# EAGLE design V4-MySensors-LoRa-V004 (EAGLE 9.3.0)
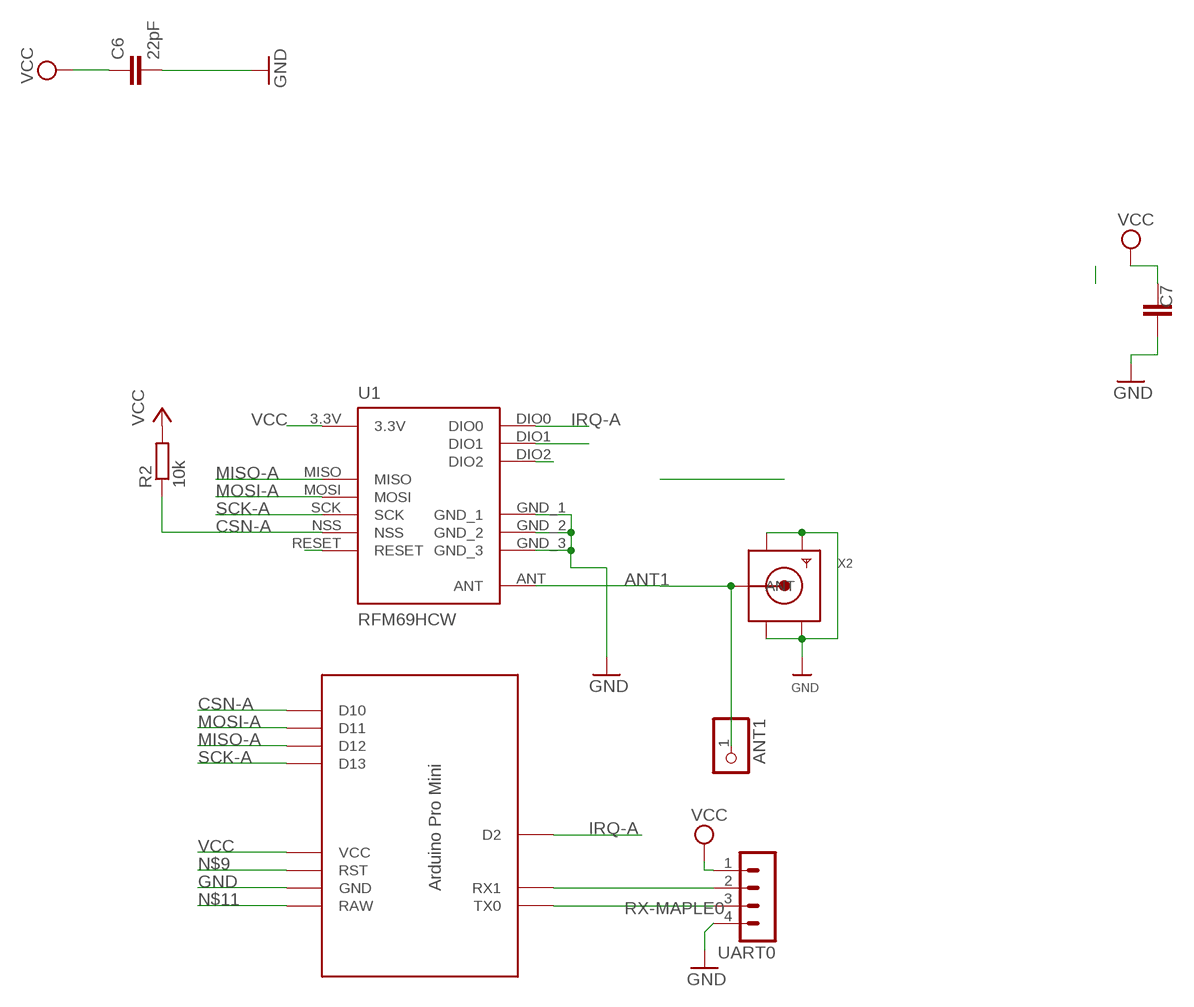
[diagram p0: schematic, sheet 1]

## Parts
ANT1  PINHD-1X1  [1X01]
C6  22pF  C-EUC0805  [C0805]
C7  C-EUC1812  [C1812]
R2  10k  R-EU_M0805  [M0805]
U1  RFM69HCW  [RFM69HCW-XXXS2]
U$1  MARTIN-PROMINI-SPI  [MARTIN-PRO-SPI]
UART0  MA04-1  [MA04-1]
X2  SMACONNECTOR_EDGE  [SMA_EDGELAUNCH]

## Nets
ANT1: ANT1.1 U1.ANT X2.P(ANT)
CSN-A: R2.1 U1.NSS U$1.D10
GND [PWR]: C6.2 C7.1 U1.GND_1 U1.GND_2 U1.GND_3 U$1.GND UART0.4 X2.GND@1(GND4) X2.GND@2(GND3) X2.GND@3(GND2) X2.GND@4(GND1)
IRQ-A: U1.DIO0 U$1.D2
MISO-A: U1.MISO U$1.D12
MOSI-A: U1.MOSI U$1.D11
N$2: U$1.RX1 UART0.2
N$3: U1.RESET
N$9: U$1.RST
N$11: U$1.RAW
N$14: U1.DIO2
N$15: U1.DIO1
RX-MAPLE0: U$1.TX0 UART0.3
SCK-A: U1.SCK U$1.D13
VCC [PWR]: C6.1 C7.2 R2.2 U1.3.3V U$1.VCC UART0.1

## Library data of the parts
ANT1 = pinhead:PINHD-1X1: PIN HEADER
C6 C7 = rcl:C-EU: CAPACITOR, European symbol; SPICEPREFIX: C
R2 = rcl:R-EU_: RESISTOR, European symbol
U1 = doug:RFM69H
U$1 = Arduino-clone:MARTIN-PROMINI-SPI
UART0 = con-lstb:MA04-1: PIN HEADER; OC_FARNELL: unknown; OC_NEWARK: unknown
X2 = adafruit:SMACONNECTOR: SMA Connector 90° DIP SMA Connector, 50 Ohm (4UConnector: 07259)

## Net classes
0 default: width 0.305 mm
1 PWR: width 0.457 mm

## Board
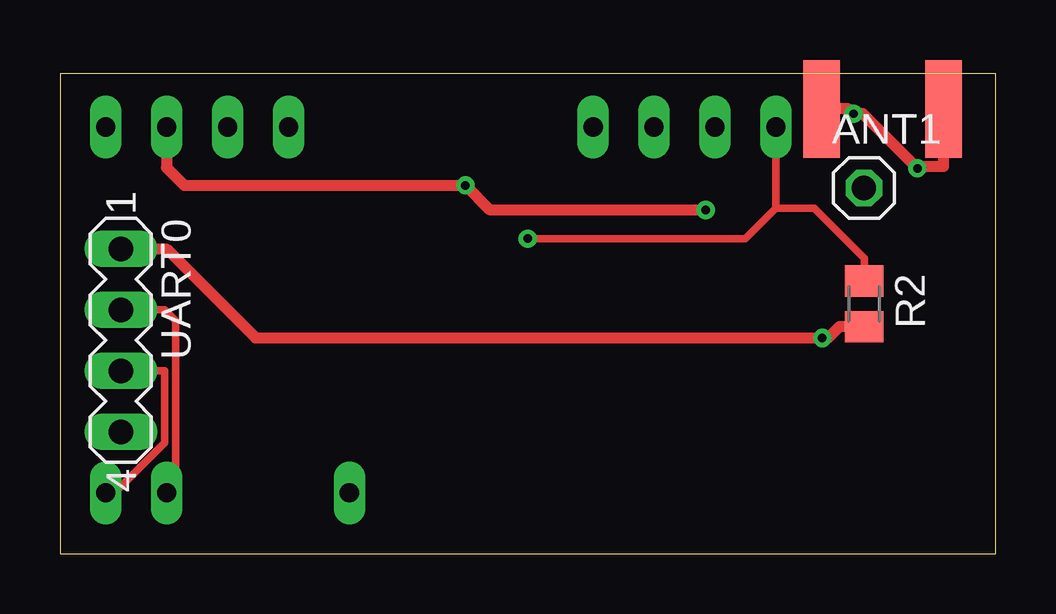
[diagram p1: board, top side]
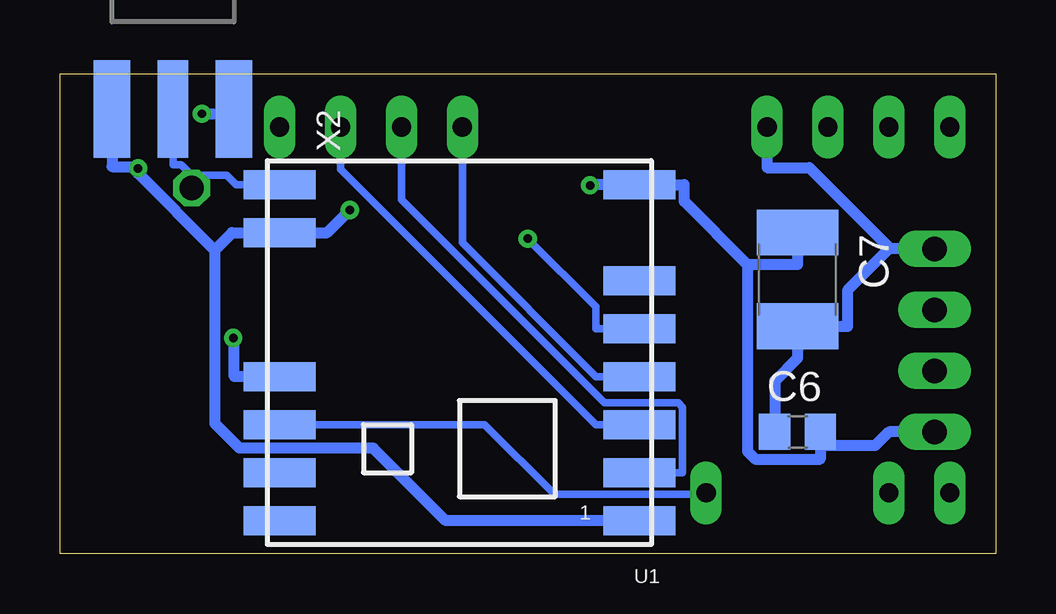
[diagram p2: board, bottom side, seen from below]

Size 39 x 20 mm. Coordinates in mm from the lower left corner, seen from the top.
Outline: 0,0 39,0 39,20 0,20 0,0
Copper layers (1*16): Top 0.035mm / dielectric 1.5mm / Bottom 0.035mm
Design rules "default": minimum track width 6mil, minimum drill 0.35mm, track to track 6mil, track to pad 6mil, pad to pad 6mil, via to via 6mil, smd to smd 6mil, copper to edge 40mil, drill to drill 6mil, minimum pad ring 10mil, minimum via ring 8mil, stop-mask expansion 4mil, vias tented up to drill 0mil, thermal gap 10mil

### Footprints (pad centres in the part's own frame; a part is rotated, then mirrored left to right if it is on the bottom)
1X01 = drill 1.016 octagon: 1 0,0
C0805 = smd 1.3 x 1.5: 1 -0.95,0; 2 0.95,0
C1812 = smd 1.9 x 3.4: 1 -1.95,0; 2 1.95,0
M0805 = smd 1.3 x 1.6: 1 -0.95,0; 2 0.95,0
RFM69HCW-XXXS2 = smd 3 x 1.2: 3.3V 7.5,1; ANT 7.5,-7; DIO0 7.5,3; DIO1 7.5,5; DIO2 7.5,7; GND_1 7.5,-5; GND_2 -7.5,-7; GND_3 -7.5,7; MISO -7.5,5; MOSI -7.5,3; NSS -7.5,-1; RESET -7.5,-3; SCK -7.5,1
MARTIN-PRO-SPI = drill 0.8 long: D2 -5.08,-3.81; D10 10.16,-21.59; D11 10.16,-19.05; D12 10.16,-16.51; D13 10.16,-13.97; GND 10.16,3.81; RAW 10.16,6.35; RST 10.16,1.27; RX1 -5.08,3.81; TX0 -5.08,6.35; VCC 10.16,-1.27
MA04-1 = drill 1.016 long: 1 -3.81,0; 2 -1.27,0; 3 1.27,0; 4 3.81,0
SMA_EDGELAUNCH = smd 4.064 x 1.524: GND@1 2.032,-2.54; GND@2 2.032,2.54 | smd 4.064 x 1.524 bottom: GND@3 2.032,2.54; GND@4 2.032,-2.54 | smd 4.064 x 1.27: P 2.032,0

### Placement (x,y rotation side)
ANT1  33.51,15.24 0 top
C6  8.26,5.08 0 bottom
C7  8.26,11.43 270 bottom
R2  33.53,10.41 270 top
U1  22.35,8.38 180 bottom
U$1  8.26,7.62 90 top
UART0  2.54,8.89 270 top
X2  34.29,20.57 270 bottom

### Tracks (layer width: path | path; a pad name or v marks a point on that pad's centre or on a via)
ANT1
  Bottom 0.305: X2.P 34.29,16.2 33.94,16.2 33.51,15.77 | U1.ANT 31.66,15.38 32.05,15.77 33.51,15.77 | ANT1.1 33.51,15.77
CSN-A  (via drill 0.35 pad 0.76)
  Top 0.305: R2.1 33.53,12.32 31.44,14.4 29.84,14.4 | v19.5,13.13 28.57,13.13 29.84,14.4 | 29.84,14.4 U$1.D10
  Bottom 0.305: U1.NSS 16.66,9.38 16.66,10.29 v19.5,13.13
GND  (via drill 0.35 pad 0.76)
  Top 0.457: X2.GND@2 32.88,18.54 v33.08,18.34 33.47,18.34 v35.75,16.06 35.82,16.13 36.83,16.13 X2.GND@1 | v26.92,14.32 17.93,14.32 v16.9,15.35 5.18,15.35 4.45,16.09 U$1.GND
  Bottom 0.457: v33.08,18.34 31.96,18.34 X2.GND@2 | 10.34,12.05 12.97,14.68 12.97,15.38 U1.GND_2 16.73,15.38 16.76,15.35 v16.9,15.35 | 10.34,12.05 10.34,4.27 10.02,3.95 7.3,3.95 7.3,4.51 | 10.34,12.05 8.26,12.05 C7.1 | 32.54,12.68 32.57,12.68 35.75,15.86 v35.75,16.06 35.82,16.13 36.83,16.13 X2.GND@1 | 32.54,12.68 31.83,13.38 U1.GND_1 27.86,13.38 v26.92,14.32 | U1.GND_3 22.93,1.38 25.94,4.4 31.51,4.4 32.54,5.42 32.54,12.68 | UART0.4 4.45,5.08 5.01,4.51 7.3,4.51 | C6.2 7.3,4.51
IRQ-A
  Bottom 0.305: U1.DIO0 21.3,5.38 18.39,2.48 12.13,2.48 U$1.D2
MISO-A
  Bottom 0.305: U1.MISO 13.05,3.38 13.05,6.11 13.23,6.29 16.3,6.29 24.77,14.76 U$1.D12
MOSI-A
  Bottom 0.305: U1.MOSI 16.66,5.38 27.3,16.03 U$1.D11
N$2
  Top 0.305: UART0.2 4.37,10.16 4.83,9.7 4.83,2.92 U$1.RX1
RX-MAPLE0
  Top 0.305: UART0.3 4.37,7.62 4.37,4.63 2.28,2.54 U$1.TX0
SCK-A
  Bottom 0.305: U1.SCK 16.66,7.38 22.23,12.95 U$1.D13
VCC  (via drill 0.35 pad 0.76)
  Top 0.457: UART0.1 4.45,12.7 8.15,8.99 v31.77,8.99 32.03,8.99 32.5,9.46 R2.2
  Bottom 0.457: U1.3.3V 31.73,7.38 31.73,8.95 v31.77,8.99 | U$1.VCC 9.53,16.09 7.77,16.09 4.45,12.77 4.45,12.7 | UART0.1 4.45,12.7 | 4.45,12.7 6.17,10.97 6.17,9.48 C7.2 8.26,8.15 9.21,7.2 C6.1